# Altium schematic sheet Mother Board Bluetooth.SchDoc
size A4
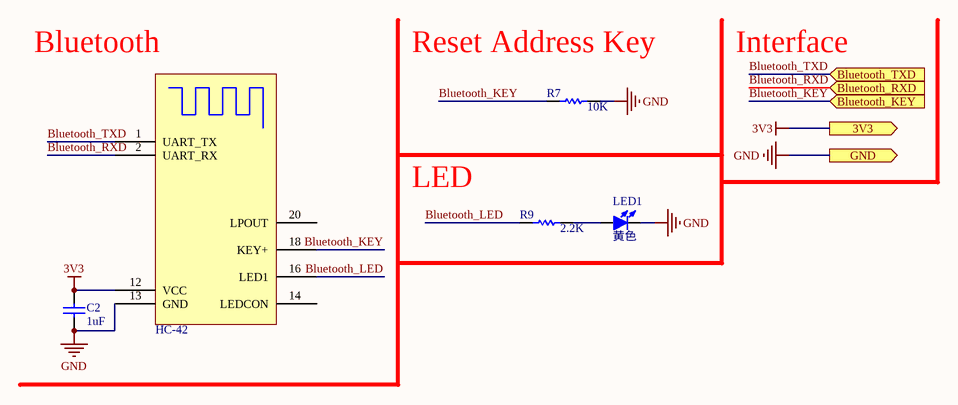
[diagram p0: Mother Board Bluetooth.SchDoc]

## Parts
C2  1uF  [C0603]
LED1  黄色  [LED 0603Y]
R7  10K  [R0603]
R9  2.2K  [R0603]
U2  HC-42  [HC-42]

## Ports
3V3 (out), Bluetooth_KEY (in), Bluetooth_RXD (in), Bluetooth_TXD (in), GND (out)

## Nets
3V3: C2.2 U2.12(VCC) ; port 3V3
GND: C2.1 LED1.K R7.1 U2.13(GND) ; port GND
Bluetooth_KEY: R7.2 U2.18(KEY+) ; port Bluetooth_KEY
Bluetooth_LED: R9.2 U2.16(LED1)
Bluetooth_RXD: U2.2(UART_RX) ; port Bluetooth_RXD
Bluetooth_TXD: U2.1(UART_TX) ; port Bluetooth_TXD
NetLED1_A: LED1.A R9.1

Not connected (* = marked no-connect by the designer): U2 14(LEDCON) 20(LPOUT)

## Notes on the sheet
- Bluetooth
- (near R7) Reset Address Key
- Interface
- LED

## Library data of the parts
C2 = Cap
LED1 = LED-SMD: 贴片LED; 版权归属: 源创客; BOM名称: 贴片LED; 学习资源: www.ooocke.com
R7 R9 = RES